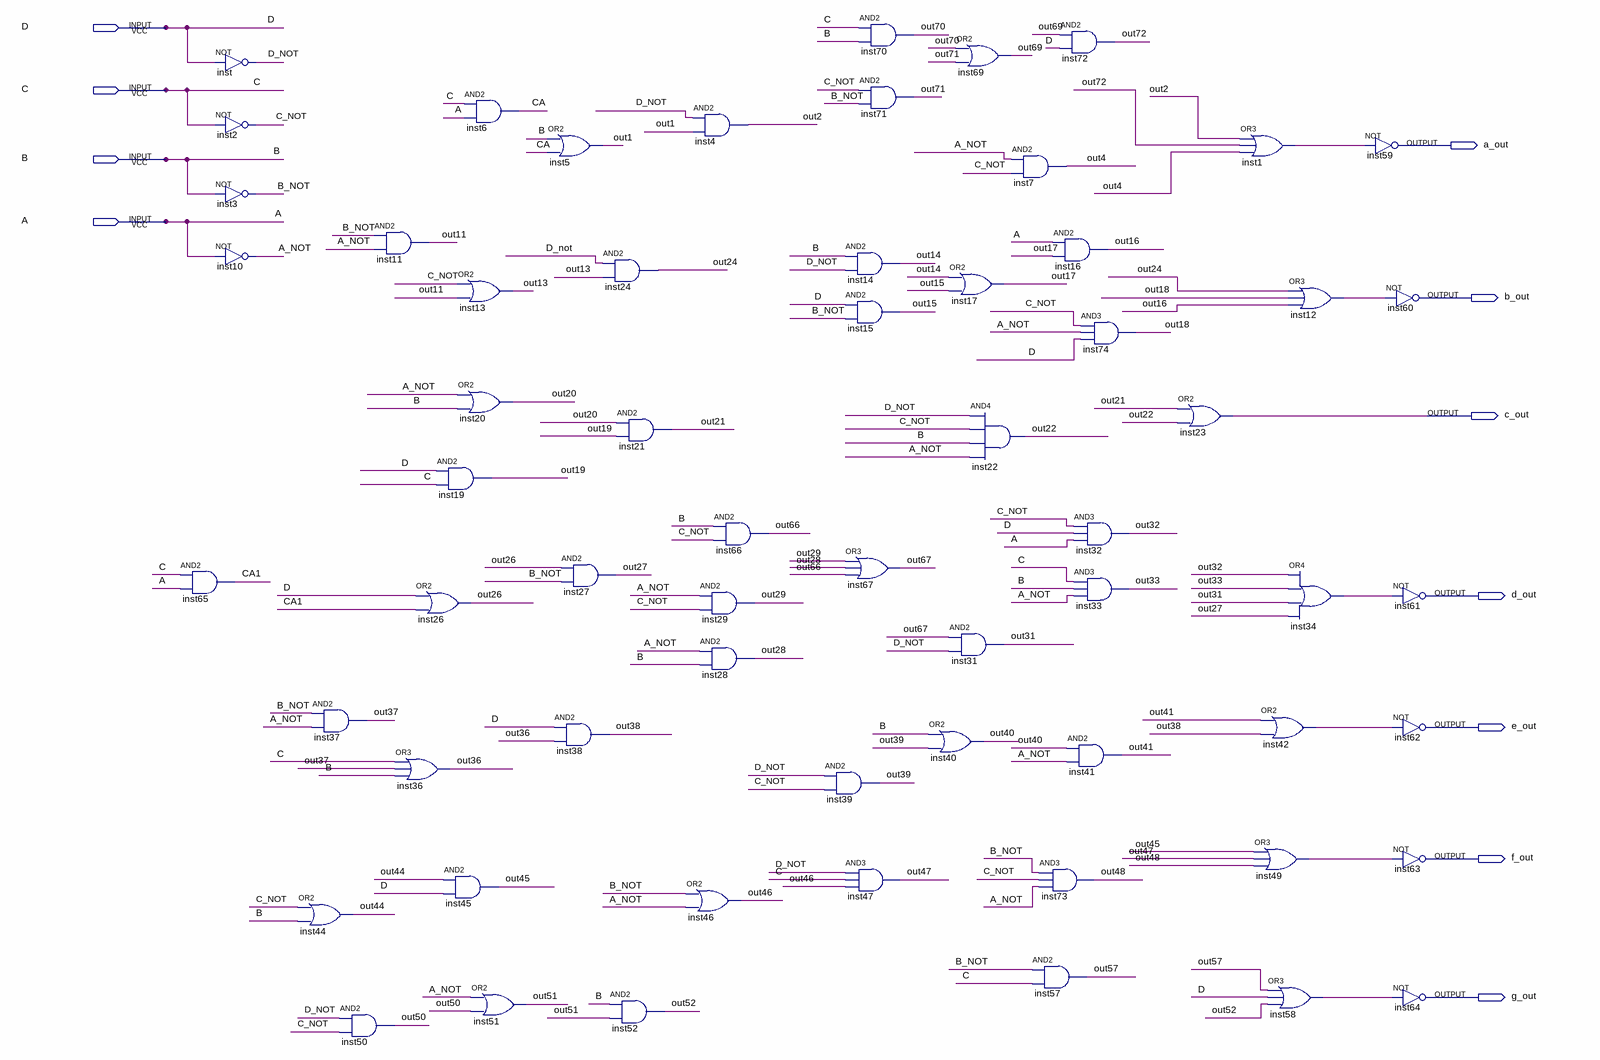
[diagram p0: schematic sheet]
// Quartus schematic Lab3.bdf as structural Verilog: 62 symbols, 11 pins
module Lab3 (
  input  D,
  input  C,
  input  B,
  input  A,
  output a_out,
  output b_out,
  output c_out,
  output d_out,
  output e_out,
  output f_out,
  output g_out
);

  wire A_NOT, B_NOT, C_NOT, CA, CA1, D_NOT, inst1_out, inst12_out, inst34_out, inst42_out, inst49_out,
       inst58_out, out1, out2, out4, out11, out13, out14, out15, out16, out17, out18, out19, out20, out21,
       out22, out24, out26, out27, out28, out29, out31, out32, out33, out36, out37, out38, out39, out40,
       out41, out44, out45, out46, out47, out48, out50, out51, out52, out57, out66, out67, out69, out70,
       out71, out72;

  and inst65 (CA1, C, A);
  not inst (D_NOT, D);
  not inst2 (C_NOT, C);
  not inst3 (B_NOT, B);
  not inst10 (A_NOT, A);
  or inst44 (out44, C_NOT, B);
  and inst37 (out37, B_NOT, A_NOT);
  and inst50 (out50, D_NOT, C_NOT);
  and inst11 (out11, B_NOT, A_NOT);
  or inst26 (out26, D, CA1);
  or inst36 (out36, C, out37, B);
  and inst6 (CA, C, A);
  or inst13 (out13, C_NOT, out11);
  or inst20 (out20, A_NOT, B);
  and inst19 (out19, D, C);
  and inst45 (out45, out44, D);
  or inst51 (out51, A_NOT, out50);
  or inst5 (out1, B, CA);
  and inst27 (out27, out26, B_NOT);
  and inst38 (out38, D, out36);
  and inst24 (out24, D_NOT, out13);
  and inst21 (out21, out20, out19);
  and inst52 (out52, B, out51);
  and inst4 (out2, D_NOT, out1);
  or inst46 (out46, B_NOT, A_NOT);
  and inst66 (out66, B, C_NOT);
  and inst29 (out29, A_NOT, C_NOT);
  and inst28 (out28, A_NOT, B);
  and inst70 (out70, C, B);
  and inst71 (out71, C_NOT, B_NOT);
  and inst14 (out14, B, D_NOT);
  and inst15 (out15, D, B_NOT);
  or inst67 (out67, out29, out28, out66);
  and inst39 (out39, D_NOT, C_NOT);
  and inst47 (out47, D_NOT, C, out46);
  or inst69 (out69, out70, out71);
  or inst17 (out17, out14, out15);
  and inst22 (out22, D_NOT, C_NOT, B, A_NOT);
  and inst31 (out31, out67, D_NOT);
  or inst40 (out40, B, out39);
  and inst7 (out4, A_NOT, C_NOT);
  and inst72 (out72, out69, D);
  and inst16 (out16, A, out17);
  and inst74 (out18, C_NOT, A_NOT, D);
  and inst32 (out32, C_NOT, D, A);
  and inst33 (out33, C, B, A_NOT);
  and inst41 (out41, out40, A_NOT);
  and inst73 (out48, B_NOT, C_NOT, A_NOT);
  and inst57 (out57, B_NOT, C);
  or inst23 (c_out, out21, out22);
  or inst1 (inst1_out, out2, out72, out4);
  or inst12 (inst12_out, out24, out18, out16);
  or inst34 (inst34_out, out32, out33, out31, out27);
  or inst42 (inst42_out, out41, out38);
  or inst49 (inst49_out, out45, out47, out48);
  or inst58 (inst58_out, out57, D, out52);
  not inst59 (a_out, inst1_out);
  not inst60 (b_out, inst12_out);
  not inst61 (d_out, inst34_out);
  not inst62 (e_out, inst42_out);
  not inst63 (f_out, inst49_out);
  not inst64 (g_out, inst58_out);
endmodule
